# Altium schematic sheet 电磁PCB.SchDoc
size A2
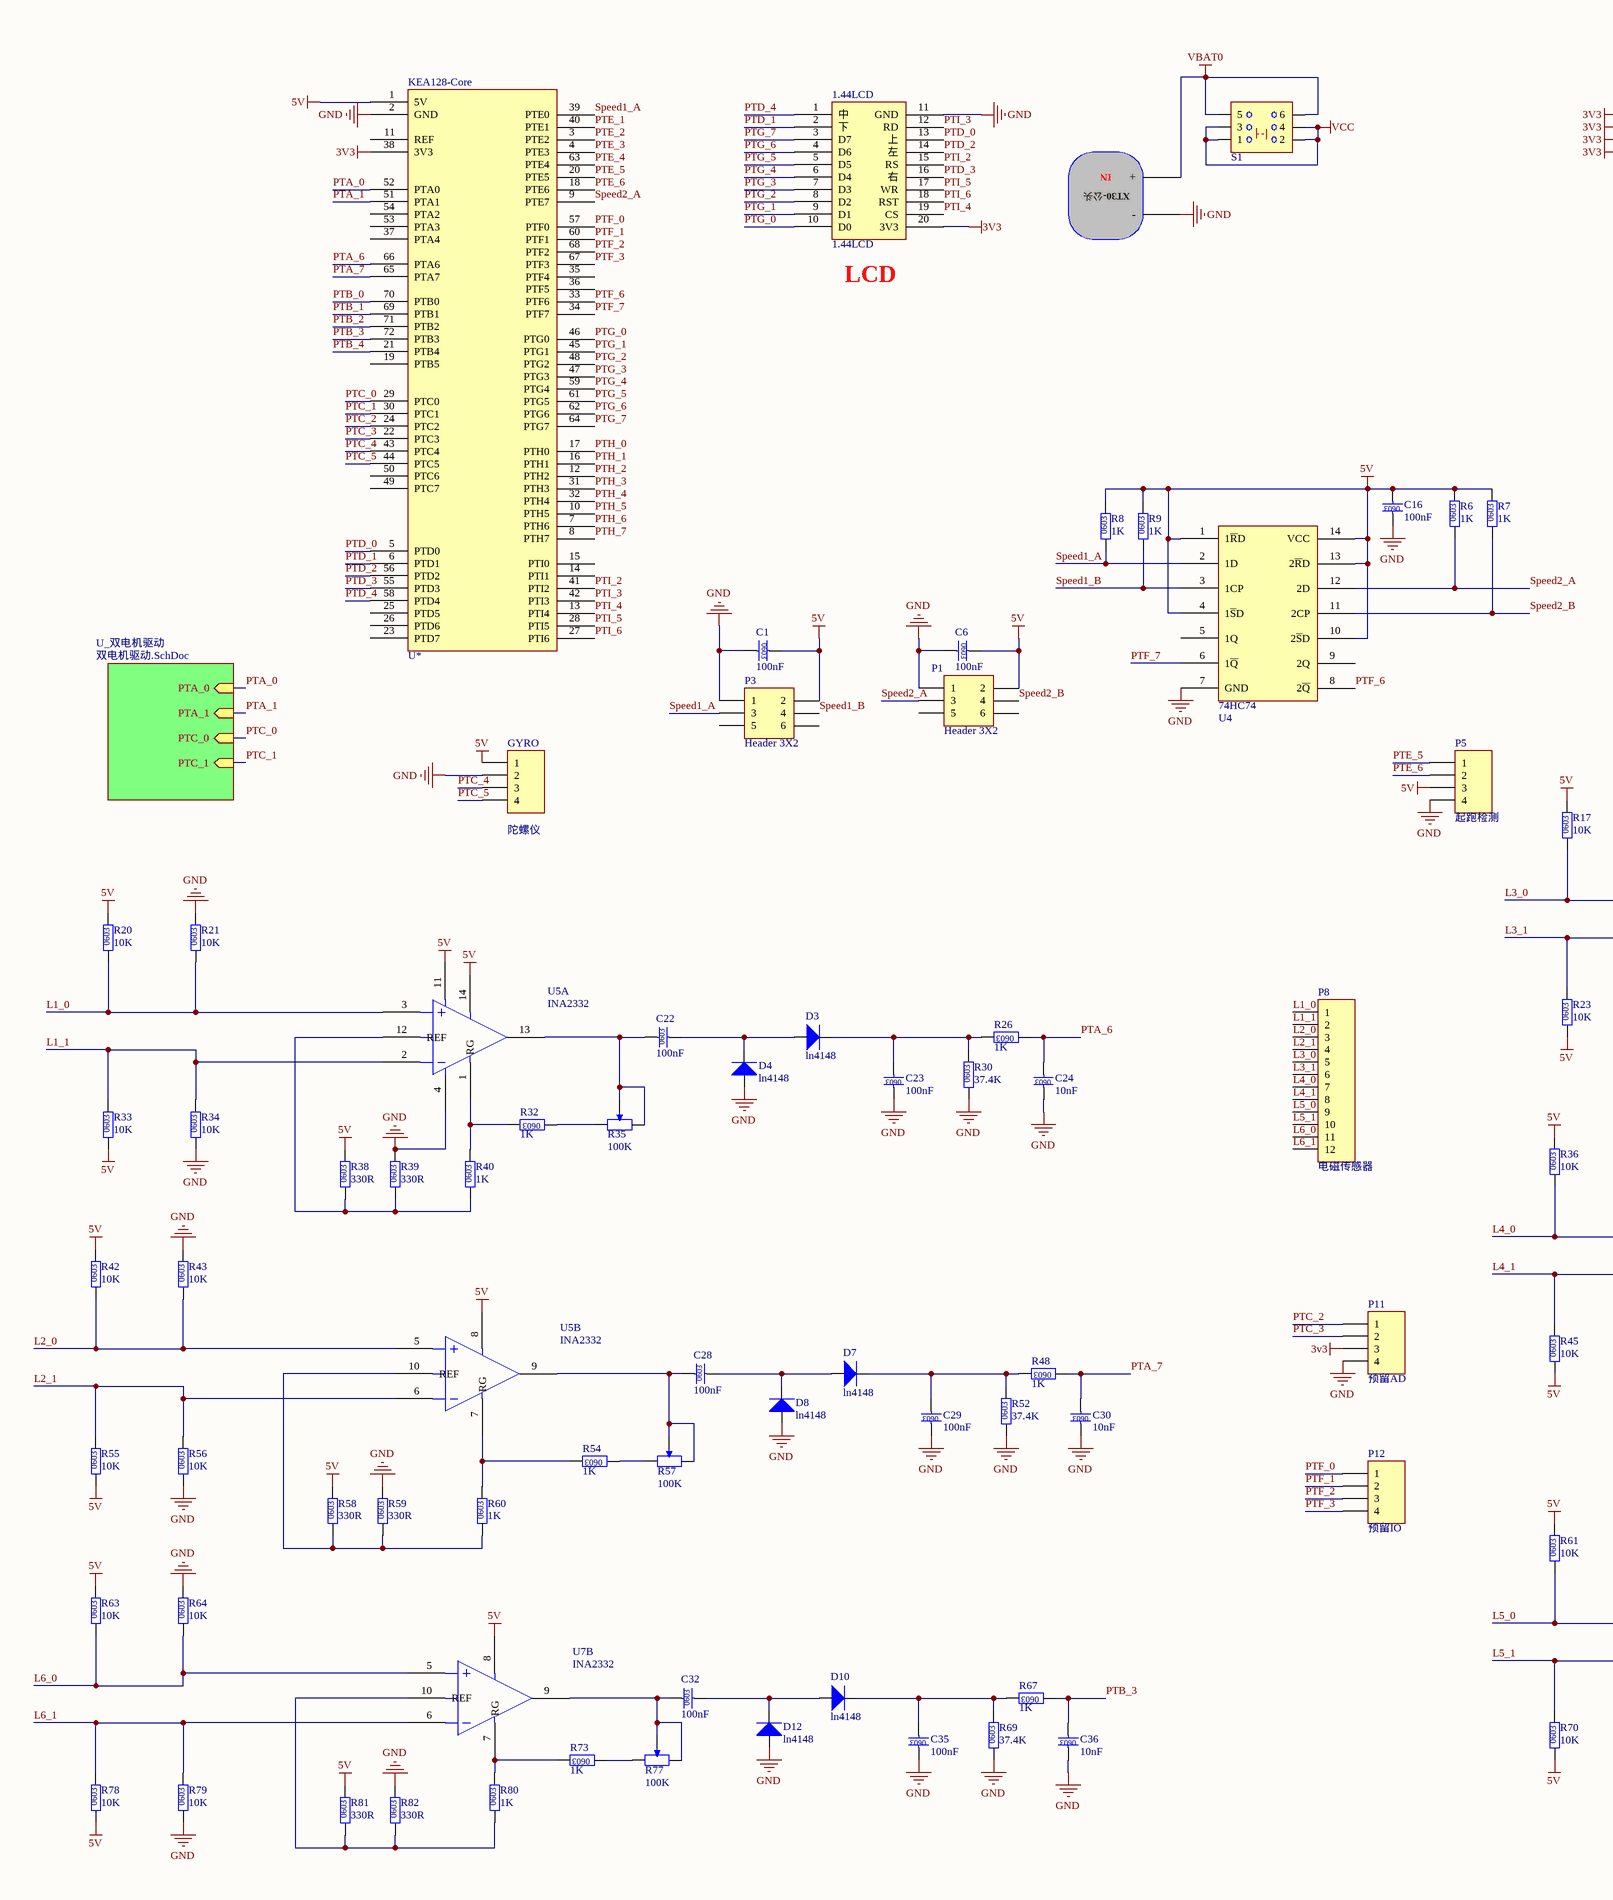
[diagram p0: 电磁PCB.SchDoc, left]
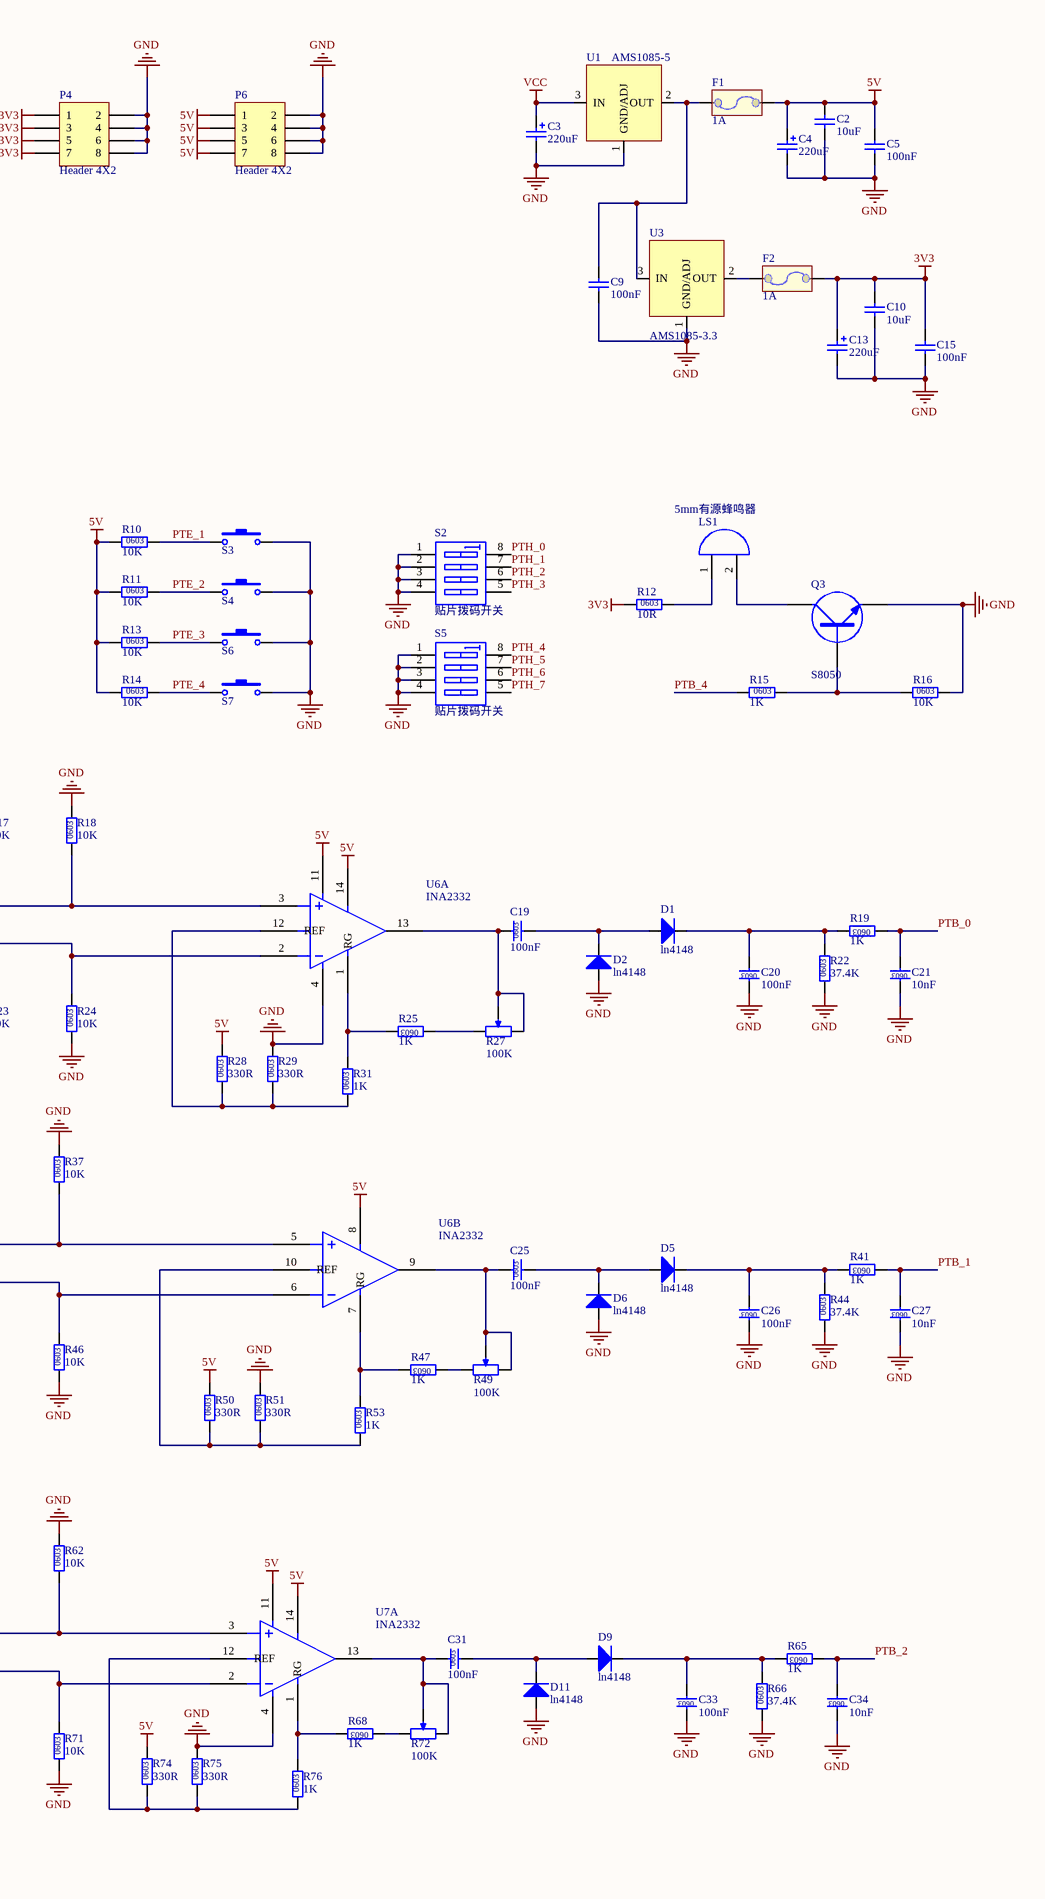
[diagram p1: 电磁PCB.SchDoc, right]

## Parts
1.44LCD  1.44LCD  [1.44LCD]
C1  100nF  [0603C]
C2  10uF  [0805]
C3  220uF  [AEC_D6.3]
C4  220uF  [AEC_D6.3]
C5  100nF  [0805]
C6  100nF  [0603C]
C9  100nF  [0805]
C10  10uF  [0805]
C13  220uF  [AEC_D6.3]
C15  100nF  [0805]
C16  100nF  [0603C]
C19  100nF  [0603C]
C20  100nF  [0603C]
C21  10nF  [0603C]
C22  100nF  [0603C]
C23  100nF  [0603C]
C24  10nF  [0603C]
C25  100nF  [0603C]
C26  100nF  [0603C]
C27  10nF  [0603C]
C28  100nF  [0603C]
C29  100nF  [0603C]
C30  10nF  [0603C]
C31  100nF  [0603C]
C32  100nF  [0603C]
C33  100nF  [0603C]
C34  10nF  [0603C]
C35  100nF  [0603C]
C36  10nF  [0603C]
D1  ln4148  [SOD-523(0603)]
D2  ln4148  [SOD-523(0603)]
D3  ln4148  [SOD-523(0603)]
D4  ln4148  [SOD-523(0603)]
D5  ln4148  [SOD-523(0603)]
D6  ln4148  [SOD-523(0603)]
D7  ln4148  [SOD-523(0603)]
D8  ln4148  [SOD-523(0603)]
D9  ln4148  [SOD-523(0603)]
D10  ln4148  [SOD-523(0603)]
D11  ln4148  [SOD-523(0603)]
D12  ln4148  [SOD-523(0603)]
F1  1A  [1206]
F2  1A  [1206]
GYRO  陀螺仪  [HDR1X4]
KEA128-Core  U*  [山外KEA核心板]
LS1  Bell  [BELL]  (value not drawn)
P1  Header 3X2  [HDR2X3]
P2  XT30-公-pcb  [XT30-垂直]  (value not drawn)
P3  Header 3X2  [HDR2X3]
P4  Header 4X2  [HDR2X4]
P5  起跑检测  [HDR1X4]
P6  Header 4X2  [HDR2X4]
P8  电磁传感器  [HDR1X12]
P11  预留AD  [HDR1X4]
P12  预留IO  [HDR1X4]
Q3  S8050  [SOT-23]
R6  1K  [0603R]
R7  1K  [0603R]
R8  1K  [0603R]
R9  1K  [0603R]
R10  10K  [0603R]
R11  10K  [0603R]
R12  10R  [0603R]
R13  10K  [0603R]
R14  10K  [0603R]
R15  1K  [0603R]
R16  10K  [0603R]
R17  10K  [0603R]
R18  10K  [0603R]
R19  1K  [0603R]
R20  10K  [0603R]
R21  10K  [0603R]
R22  37.4K  [0603R]
R23  10K  [0603R]
R24  10K  [0603R]
R25  1K  [0603R]
R26  1K  [0603R]
R27  100K  [3362P]
R28  330R  [0603R]
R29  330R  [0603R]
R30  37.4K  [0603R]
R31  1K  [0603R]
R32  1K  [0603R]
R33  10K  [0603R]
R34  10K  [0603R]
R35  100K  [3362P]
R36  10K  [0603R]
R37  10K  [0603R]
R38  330R  [0603R]
R39  330R  [0603R]
R40  1K  [0603R]
R41  1K  [0603R]
R42  10K  [0603R]
R43  10K  [0603R]
R44  37.4K  [0603R]
R45  10K  [0603R]
R46  10K  [0603R]
R47  1K  [0603R]
R48  1K  [0603R]
R49  100K  [3362P]
R50  330R  [0603R]
R51  330R  [0603R]
R52  37.4K  [0603R]
R53  1K  [0603R]
R54  1K  [0603R]
R55  10K  [0603R]
R56  10K  [0603R]
R57  100K  [3362P]
R58  330R  [0603R]
R59  330R  [0603R]
R60  1K  [0603R]
R61  10K  [0603R]
R62  10K  [0603R]
R63  10K  [0603R]
R64  10K  [0603R]
R65  1K  [0603R]
R66  37.4K  [0603R]
R67  1K  [0603R]
R68  1K  [0603R]
R69  37.4K  [0603R]
R70  10K  [0603R]
R71  10K  [0603R]
R72  100K  [3362P]
R73  1K  [0603R]
R74  330R  [0603R]
R75  330R  [0603R]
R76  1K  [0603R]
R77  100K  [3362P]
R78  10K  [0603R]
R79  10K  [0603R]
R80  1K  [0603R]
R81  330R  [0603R]
R82  330R  [0603R]
S1  SWITCH  [双排两档6脚]  (value not drawn)
S2  贴片拨码开关  [拨码开关4-2.54间距]
S3  SW-PB  [SMT_BUTTON]  (value not drawn)
S4  SW-PB  [SMT_BUTTON]  (value not drawn)
S5  贴片拨码开关  [拨码开关4-2.54间距]
S6  SW-PB  [SMT_BUTTON]  (value not drawn)
S7  SW-PB  [SMT_BUTTON]  (value not drawn)
U1  AMS1085-5  [LR7843_0]
U3  AMS1085-3.3  [LR7843_0]
U4  74HC74  [TSSOP14]  (value not drawn)
U5  INA2332  [TSSOP14]  (parts A,B of 2)
U6  INA2332  [TSSOP14]  (parts A,B of 2)
U7  INA2332  [TSSOP14]  (parts A,B of 2)

## Sub-sheets
U_双电机驱动 = 双电机驱动.SchDoc: PTA_0 (in), PTA_1 (in), PTC_0 (in), PTC_1 (in)

## Nets
3V3: 1.44LCD.20(3V3) C10.2 C13.1 C15.2 F2.2 KEA128-Core.38(3V3) P4.1 P4.3 P4.5 P4.7 P11.3 R12.1
5V: C1.1 C2.2 C4.1 C5.2 C6.1 C16.2 F1.2 GYRO.1 KEA128-Core.1(5V) P1.2 P3.2 P5.3 P6.1 P6.3 P6.5 P6.7 R6.2 R7.2 R8.2 R9.2 R10.1 R11.1 R13.1 R14.1 R17.2 R20.2 R23.1 R28.2 R33.1 R36.2 R38.2 R42.2 R45.1 R50.2 R55.1 R58.2 R61.2 R63.2 R70.1 R74.2 R78.1 R81.2 U4.1(1~{R}D) U4.4(1~{S}D) U4.10(2~{S}D) U4.13(2~{R}D) U4.14(VCC) U5.8(SHDN) U5.11 U5.14(SHDN) U6.8(SHDN) U6.11 U6.14(SHDN) U7.8(SHDN) U7.11 U7.14(SHDN)
GND: 1.44LCD.11(GND) C1.2 C2.1 C3.2 C4.2 C5.1 C6.2 C9.1 C10.1 C13.2 C15.1 C16.1 C20.1 C21.1 C23.1 C24.1 C26.1 C27.1 C29.1 C30.1 C33.1 C34.1 C35.1 C36.1 D2.1 D4.1 D6.1 D8.1 D11.1 D12.1 GYRO.2 KEA128-Core.2(GND) P1.1 P2.0(-) P3.1 P4.2 P4.4 P4.6 P4.8 P5.4 P6.2 P6.4 P6.6 P6.8 P11.4 Q3.2(E) R16.2 R18.2 R21.2 R22.1 R24.1 R29.2 R30.1 R34.1 R37.2 R39.2 R43.2 R44.1 R46.1 R51.2 R52.1 R56.1 R59.2 R62.2 R64.2 R66.1 R69.1 R71.1 R75.2 R79.1 R82.2 S2.1(A1) S2.2(A2) S2.3(A3) S2.4(A4) S3.2 S4.2 S5.1(A1) S5.2(A2) S5.3(A3) S5.4(A4) S6.2 S7.2 U1.1(GND/ADJ) U3.1(GND/ADJ) U4.7(GND) U5.4 U6.4 U7.4
VBAT0: P2.1(+) S1.5 S1.6
VCC: C3.1 S1.1 S1.2 S1.3 S1.4 U1.3(IN)
L1_0: P8.1 R20.1 R21.1 U5.3
L1_1: P8.2 R33.2 R34.2 U5.2
L2_0: P8.3 R42.1 R43.1 U5.5
L2_1: P8.4 R55.2 R56.2 U5.6
L3_0: P8.5 R17.1 R18.1 U6.3
L3_1: P8.6 R23.2 R24.2 U6.2
L4_0: P8.7 R36.1 R37.1 U6.5
L4_1: P8.8 R45.2 R46.2 U6.6
L5_0: P8.9 R61.1 R62.1 U7.3
L5_1: P8.10 R70.2 R71.2 U7.2
L6_0: P8.11 R63.1 R64.1 U7.5
L6_1: P8.12 R78.2 R79.2 U7.6
PTA_0: KEA128-Core.52(PTA0) ; sheet U_双电机驱动/PTA_0
PTA_1: KEA128-Core.51(PTA1) ; sheet U_双电机驱动/PTA_1
PTA_6: C24.2 KEA128-Core.66(PTA6) R26.1
PTA_7: C30.2 KEA128-Core.65(PTA7) R48.1
PTB_0: C21.2 KEA128-Core.70(PTB0) R19.1
PTB_1: C27.2 KEA128-Core.69(PTB1) R41.1
PTB_2: C34.2 KEA128-Core.71(PTB2) R65.1
PTB_3: C36.2 KEA128-Core.72(PTB3) R67.1
PTB_4: KEA128-Core.21(PTB4) R15.1
PTC_0: KEA128-Core.29(PTC0) ; sheet U_双电机驱动/PTC_0
PTC_1: KEA128-Core.30(PTC1) ; sheet U_双电机驱动/PTC_1
PTC_2: KEA128-Core.24(PTC2) P11.1
PTC_3: KEA128-Core.22(PTC3) P11.2
PTC_4: GYRO.3 KEA128-Core.43(PTC4)
PTC_5: GYRO.4 KEA128-Core.44(PTC5)
PTD_0: 1.44LCD.13(上) KEA128-Core.5(PTD0)
PTD_1: 1.44LCD.2(下) KEA128-Core.6(PTD1)
PTD_2: 1.44LCD.14(左) KEA128-Core.56(PTD2)
PTD_3: 1.44LCD.16(右) KEA128-Core.55(PTD3)
PTD_4: 1.44LCD.1(中) KEA128-Core.58(PTD4)
PTE_1: KEA128-Core.40(PTE1) R10.2 S3.1
PTE_2: KEA128-Core.3(PTE2) R11.2 S4.1
PTE_3: KEA128-Core.4(PTE3) R13.2 S6.1
PTE_4: KEA128-Core.63(PTE4) R14.2 S7.1
PTE_5: KEA128-Core.20(PTE5) P5.1
PTE_6: KEA128-Core.18(PTE6) P5.2
PTF_0: KEA128-Core.57(PTF0) P12.1
PTF_1: KEA128-Core.60(PTF1) P12.2
PTF_2: KEA128-Core.68(PTF2) P12.3
PTF_3: KEA128-Core.67(PTF3) P12.4
PTF_6: KEA128-Core.33(PTF6) U4.8(2~{Q})
PTF_7: KEA128-Core.34(PTF7) U4.6(1~{Q})
PTG_0: 1.44LCD.10(D0) KEA128-Core.46(PTG0)
PTG_1: 1.44LCD.9(D1) KEA128-Core.45(PTG1)
PTG_2: 1.44LCD.8(D2) KEA128-Core.48(PTG2)
PTG_3: 1.44LCD.7(D3) KEA128-Core.47(PTG3)
PTG_4: 1.44LCD.6(D4) KEA128-Core.59(PTG4)
PTG_5: 1.44LCD.5(D5) KEA128-Core.61(PTG5)
PTG_6: 1.44LCD.4(D6) KEA128-Core.62(PTG6)
PTG_7: 1.44LCD.3(D7) KEA128-Core.64(PTG7)
PTH_0: KEA128-Core.17(PTH0) S2.8(B1)
PTH_1: KEA128-Core.16(PTH1) S2.7(B2)
PTH_2: KEA128-Core.12(PTH2) S2.6(B3)
PTH_3: KEA128-Core.31(PTH3) S2.5(B4)
PTH_4: KEA128-Core.32(PTH4) S5.8(B1)
PTH_5: KEA128-Core.10(PTH5) S5.7(B2)
PTH_6: KEA128-Core.7(PTH6) S5.6(B3)
PTH_7: KEA128-Core.8(PTH7) S5.5(B4)
PTI_2: 1.44LCD.15(RS) KEA128-Core.41(PTI2)
PTI_3: 1.44LCD.12(RD) KEA128-Core.42(PTI3)
PTI_4: 1.44LCD.19(CS) KEA128-Core.13(PTI4)
PTI_5: 1.44LCD.17(WR) KEA128-Core.28(PTI5)
PTI_6: 1.44LCD.18(RST) KEA128-Core.27(PTI6)
Speed1_A: KEA128-Core.39(PTE0) P3.3 R8.1 U4.2(1D)
Speed1_B: P3.4 R9.1 U4.3(1CP)
Speed2_A: KEA128-Core.9(PTE7) P1.3 R6.1 U4.12(2D)
Speed2_B: P1.4 R7.1 U4.11(2CP)
NetC9_2: C9.2 F1.1 U1.2(OUT) U3.3(IN)
NetC19_1: C19.1 R27.1(TOP) R27.2(TAP) U6.13
NetC19_2: C19.2 D1.1 D2.2
NetC20_2: C20.2 D1.2 R19.2 R22.2
NetC22_1: C22.1 R35.1(TOP) R35.2(TAP) U5.13
NetC22_2: C22.2 D3.1 D4.2
NetC23_2: C23.2 D3.2 R26.2 R30.2
NetC25_1: C25.1 R49.1(TOP) R49.2(TAP) U6.9
NetC25_2: C25.2 D5.1 D6.2
NetC26_2: C26.2 D5.2 R41.2 R44.2
NetC28_1: C28.1 R57.1(TOP) R57.2(TAP) U5.9
NetC28_2: C28.2 D7.1 D8.2
NetC29_2: C29.2 D7.2 R48.2 R52.2
NetC31_1: C31.1 R72.1(TOP) R72.2(TAP) U7.13
NetC31_2: C31.2 D9.1 D11.2
NetC32_1: C32.1 R77.1(TOP) R77.2(TAP) U7.9
NetC32_2: C32.2 D10.1 D12.2
NetC33_2: C33.2 D9.2 R65.2 R66.2
NetC35_2: C35.2 D10.2 R67.2 R69.2
NetF2_1: F2.1 U3.2(OUT)
NetLS1_1: LS1.1(A) R12.2
NetLS1_2: LS1.2(B) Q3.3(C)
NetQ3_1: Q3.1(B) R15.2 R16.1
NetR25_1: R25.1 R27.3(BOT)
NetR25_2: R25.2 R31.2 U6.1(RG)
NetR28_1: R28.1 R29.1 R31.1 U6.12(REF)
NetR32_1: R32.1 R35.3(BOT)
NetR32_2: R32.2 R40.2 U5.1(RG)
NetR38_1: R38.1 R39.1 R40.1 U5.12(REF)
NetR47_1: R47.1 R49.3(BOT)
NetR47_2: R47.2 R53.2 U6.7(RG)
NetR50_1: R50.1 R51.1 R53.1 U6.10(REF)
NetR54_1: R54.1 R57.3(BOT)
NetR54_2: R54.2 R60.2 U5.7(RG)
NetR58_1: R58.1 R59.1 R60.1 U5.10(REF)
NetR68_1: R68.1 R72.3(BOT)
NetR68_2: R68.2 R76.2 U7.1(RG)
NetR73_1: R73.1 R77.3(BOT)
NetR73_2: R73.2 R80.2 U7.7(RG)
NetR74_1: R74.1 R75.1 R76.1 U7.12(REF)
NetR80_1: R80.1 R81.1 R82.1 U7.10(REF)

Not connected (* = marked no-connect by the designer): KEA128-Core 11(REF) 14(PTI1) 15(PTI0) 19(PTB5) 23(PTD7) 25(PTD5) 26(PTD6) 35(PTF4) 36(PTF5) 37(PTA4) 49(PTC7) 50(PTC6) 53(PTA3) 54(PTA2); P1 5 6; P3 5 6; U4 5(1Q) 9(2Q)

## Notes on the sheet
- (near 1.44LCD) LCD
- (in symbol 0603_Cap) 0603
- (in symbol 0603_Res) 0603
- (in symbol Bell) 5mm有源蜂鸣器
- (in symbol XT30-公头) IN

## Library data of the parts
C1 C6 C16 C19-C36 = 0603_Cap: Capacitor
C2 C5 C9 C10 C15 = Cap: Capacitor
C3 C4 C13 = Cap Pol1: Polarized Capacitor (Radial)
D1-D12 = Diode: Typical INFRARED GaAs doide
F1 F2 = Fuse
GYRO P5 P11 P12 = Header 4: Header, 4-Pin; LatestRevisionDate: 17-Jul-2002; LatestRevisionNote: Re-released for DXP Platform.; Publisher: Altium Limited
KEA128-Core = KEA128-Core
P1 P3 = Header 3X2: Header, 3-Pin, Dual row; LatestRevisionDate: 17-Jul-2002; LatestRevisionNote: Re-released for DXP Platform.; Publisher: Altium Limited
P2 = XT30-公头
P4 P6 = Header 4X2: Header, 4-Pin, Dual row; LatestRevisionDate: 17-Jul-2002; LatestRevisionNote: Re-released for DXP Platform.; Publisher: Altium Limited
P8 = Header 12: Header, 12-Pin; LatestRevisionDate: 17-Jul-2002; LatestRevisionNote: Re-released for DXP Platform.; Publisher: Altium Limited
Q3 = NPN: NPN Transistor
R6-R26 R28-R34 R36-R48 R50-R56 R58-R71 R73-R76 R78-R82 = 0603_Res: Resistor
R27 R35 R49 R57 R72 R77 = RPot: Potentiometer
S2 S5 = SW DIP-4: DIP Switch, 4 Position, SPST; Published: 24-Mar-1999; LatestRevisionDate: 29-May-2009; LatestRevisionNote: IPC-7351 Footprint Added.; PackageVersion: Dec-2002; PackageReference: SO8; Publisher: Altium Limited; PackageDescription: 8-Pin Small Outline Integrated Circuit 1.27 mm Pitch; Code_JEDEC: MS-012-AA; Code_IPC: SOIC127P600-8
S3 S4 S6 S7 = SW-PB: Switch
U1 U3 = U22
U5-U7 = INA2332_1
LS1 = Bell: Published: 24-Mar-1999; LatestRevisionDate: 17-Jul-2002; LatestRevisionNote: Re-released for DXP Platform.; PackageReference: PIN2; Publisher: Altium Limited
S1 = SWITCH: LatestRevisionDate: 17-Jul-2002; LatestRevisionNote: Re-released for DXP Platform.; Publisher: Altium Limited